# Altium schematic sheet TopSheet.SchDoc
size A4; CompanyName: Technische Hochschule Nürnberg Georg Simon Ohm; Organization: UltraZohm; Address1: Kesslerplatz 12; Address2: 90489 Nürnberg; Address3: GERMANY; DocumentNumber: 1; SheetNumber: 1; SheetTotal: 3; Website: www.ultrazohm.com
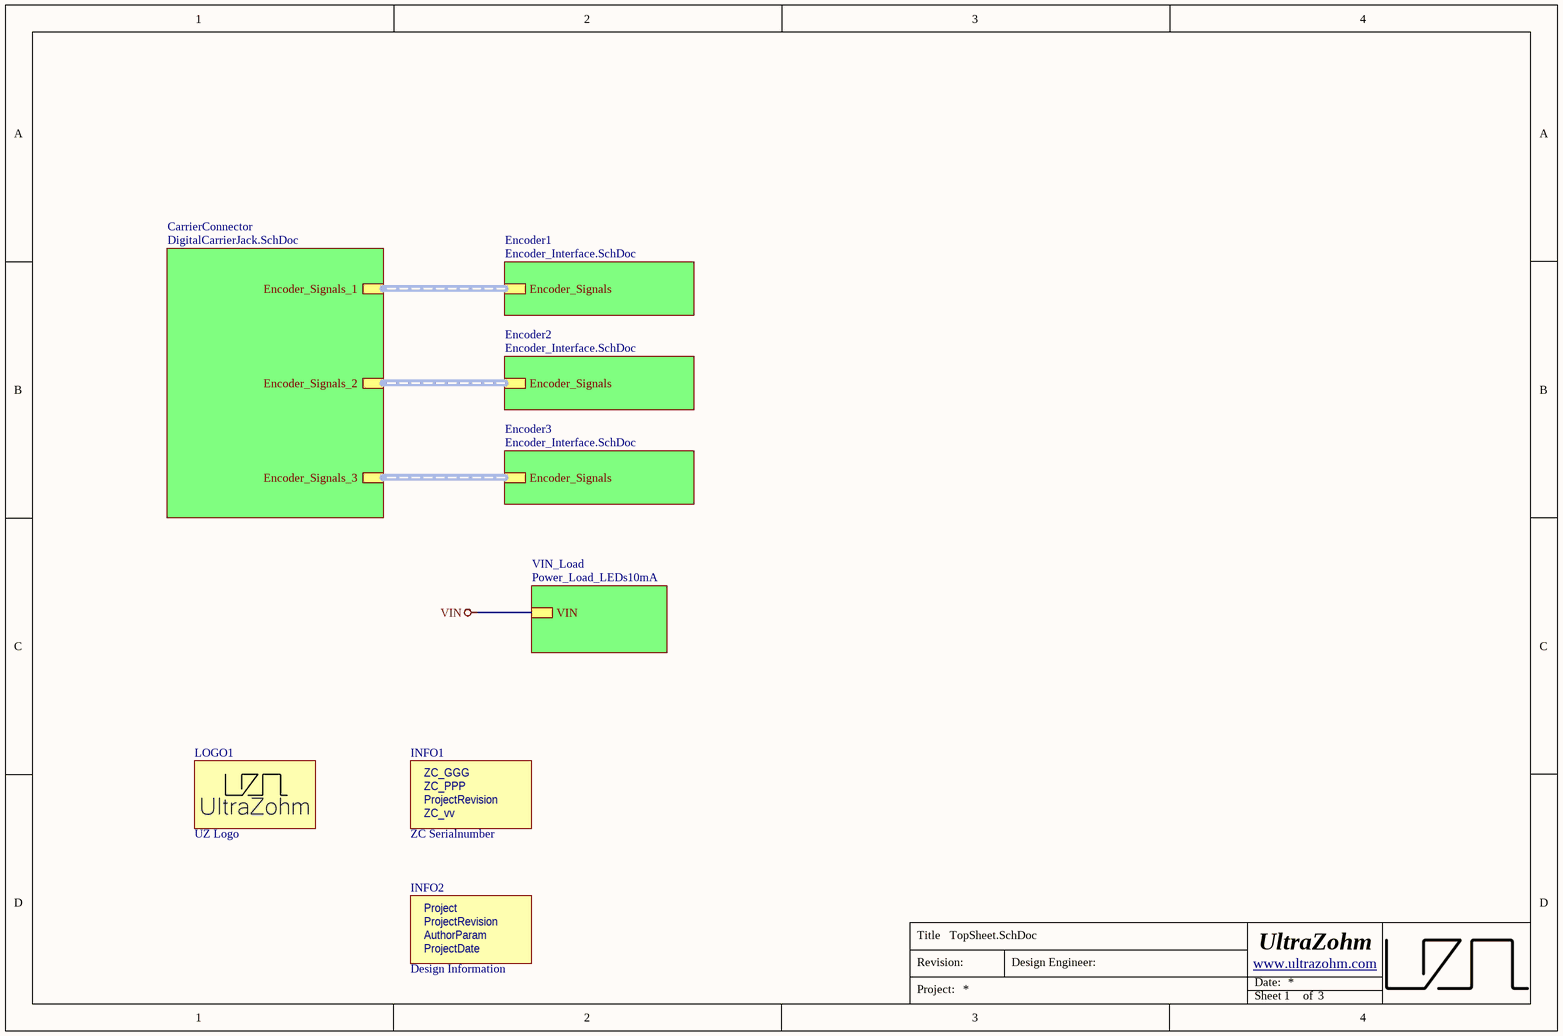
[diagram p0: TopSheet.SchDoc]

## Parts
INFO1  ZC Serialnumber  [ZC-Serial]  (no BOM)
INFO2  Design Information  [Design_info]  (no BOM)
LOGO1  UZ Logo  [UZ_Logo_small]  (no BOM)

## Sub-sheets
CarrierConnector = DigitalCarrierJack.SchDoc: Encoder_Signals_2 (harness Encoder_Signals), Encoder_Signals_1 (harness Encoder_Signals), Encoder_Signals_3 (harness Encoder_Signals)
Encoder1 = Encoder_Interface.SchDoc: Encoder_Signals (harness Encoder_Signals)
Encoder2 = Encoder_Interface.SchDoc: Encoder_Signals (harness Encoder_Signals)
Encoder3 = Encoder_Interface.SchDoc: Encoder_Signals (harness Encoder_Signals)
VIN_Load = Power_Load_LEDs10mA: VIN

## Nets
VIN: sheet VIN_Load/VIN

## Buses and harness runs
harness sheet CarrierConnector/Encoder_Signals_1 = sheet Encoder1/Encoder_Signals
harness sheet CarrierConnector/Encoder_Signals_2 = sheet Encoder2/Encoder_Signals
harness sheet CarrierConnector/Encoder_Signals_3 = sheet Encoder3/Encoder_Signals

## Notes on the sheet
- Title
- Revision:
- Design Engineer:
- Date:
- Project:
- Sheet
- of
- (in symbol Design Information) Project; ProjectRevision; AuthorParam; ProjectDate
- (in symbol ZC-Serial) ZC_GGG; ZC_PPP; ProjectRevision; ZC_vv

## Library data of the parts
INFO1 = ZC-Serial: Manufacturer: UltraZohm; Value: GGG-PPP-VVvv; Created from: FRosner; Manufacturer Part Number: ZC-Serial; PartID: 58; Created On: 15/04/2025 09:17:14; ComponentLink1Description: https://docs.ultrazohm.com/; ComponentLink1URL: homepage; Component Type: ZC Serialnumber; Last Updated: 15/04/2025 09:17:14; Supplier 1: -; Supplier Part Number 1: -; Type: Serial Number; Live Cycle Status: 1
INFO2 = Design Information: Manufacturer: UltraZohm; Created from: MGremer; Manufacturer Part Number: Design Information; PartID: 12; Created On: 03/11/2021 09:04:23; ComponentLink1Description: https://docs.ultrazohm.com/; ComponentLink1URL: homepage; Component Type: Design Information; Last Updated: 15/04/2025 09:29:36; Supplier 1: -; Supplier Part Number 1: -; Type: Design Information; Value: Design Information; Live Cycle Status: 1
LOGO1 = Logo small: Manufacturer: UltraZohm; Created from: MGremer; Created: Jan2021_Liegmann; Value: Logo; Manufacturer Part Number: Logo small; PartID: 10; Created On: 03.11.2021 09:04:23; ComponentLink1Description: https://docs.ultrazohm.com/; ComponentLink1URL: homepage; Component Type: Logo; Last Updated: 03.11.2021 09:05:50; Supplier 1: -; Supplier Part Number 1: -; Type: Logo; Live Cycle Status: 1